# EAGLE design audio_switch (EAGLE 7.4.0)
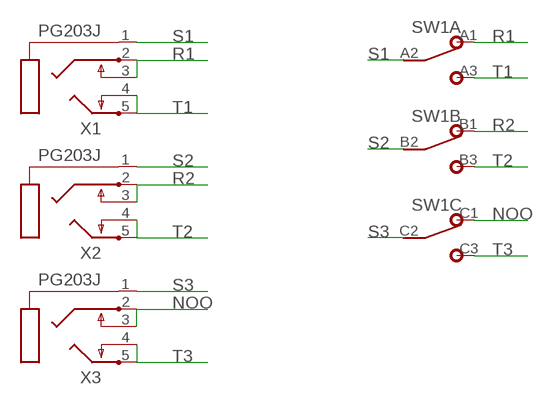
[diagram p0: schematic, sheet 1]

## Parts
SW1  3PDT  [3PDT]
X1  PG203J  [PG203J]
X2  PG203J  [PG203J]
X3  PG203J  [PG203J]

## Nets
NOO: SW1.C1 X3.2 X3.3
R1: SW1.A1 X1.2 X1.3
R2: SW1.B1 X2.2 X2.3
S1: SW1.A2 X1.1
S2: SW1.B2 X2.1
S3: SW1.C2 X3.1
T1: SW1.A3 X1.4 X1.5
T2: SW1.B3 X2.4 X2.5
T3: SW1.C3 X3.4 X3.5

## Library data of the parts
SW1 = gm-switches:3PDT
X1-X3 = con-hirschmann:PG203J: MIC/HEADPHONE JACK KS-S stereo microphone/headphone jack PG203JN (Schukat); OC_FARNELL: unknown; OC_NEWARK: unknown

## Board
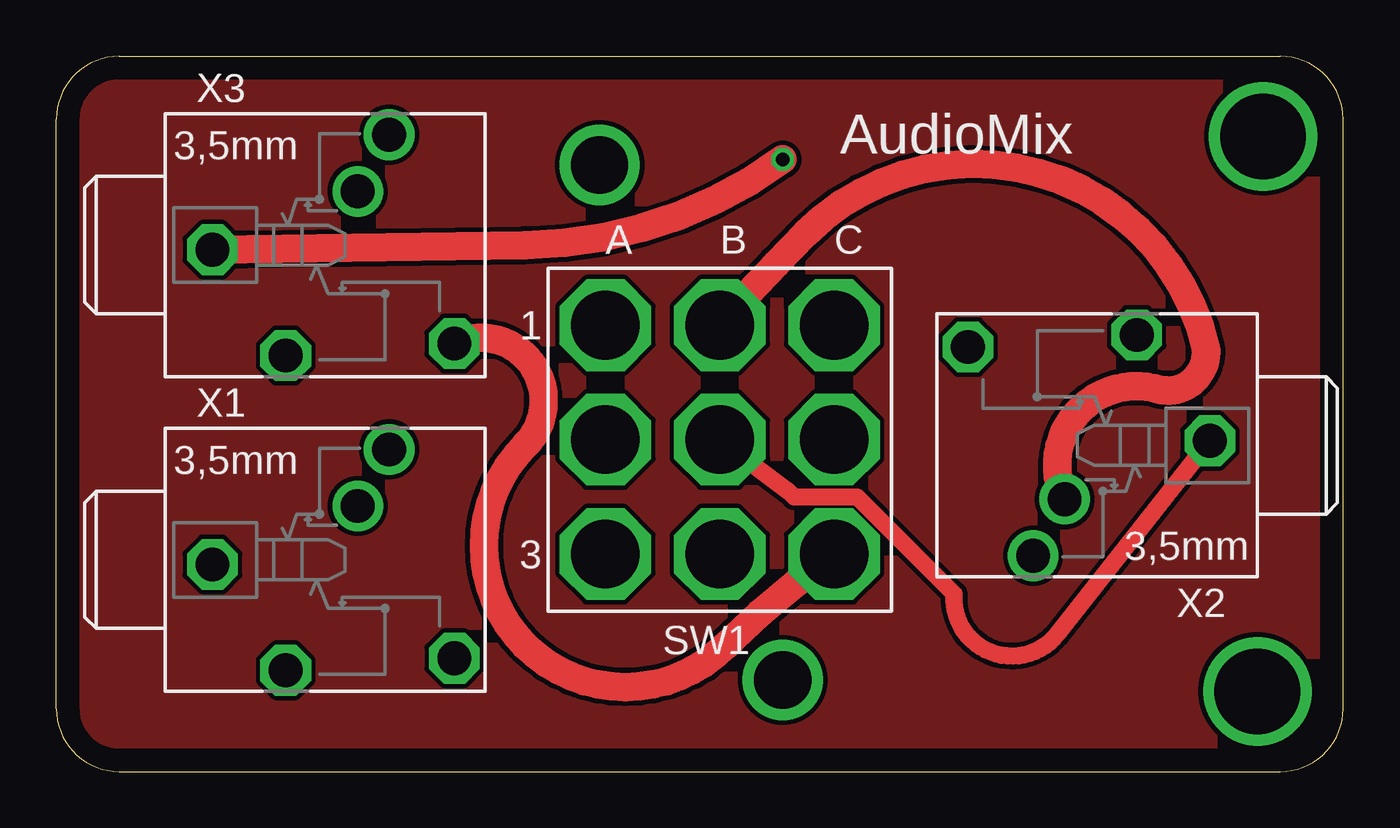
[diagram p1: board, top side]
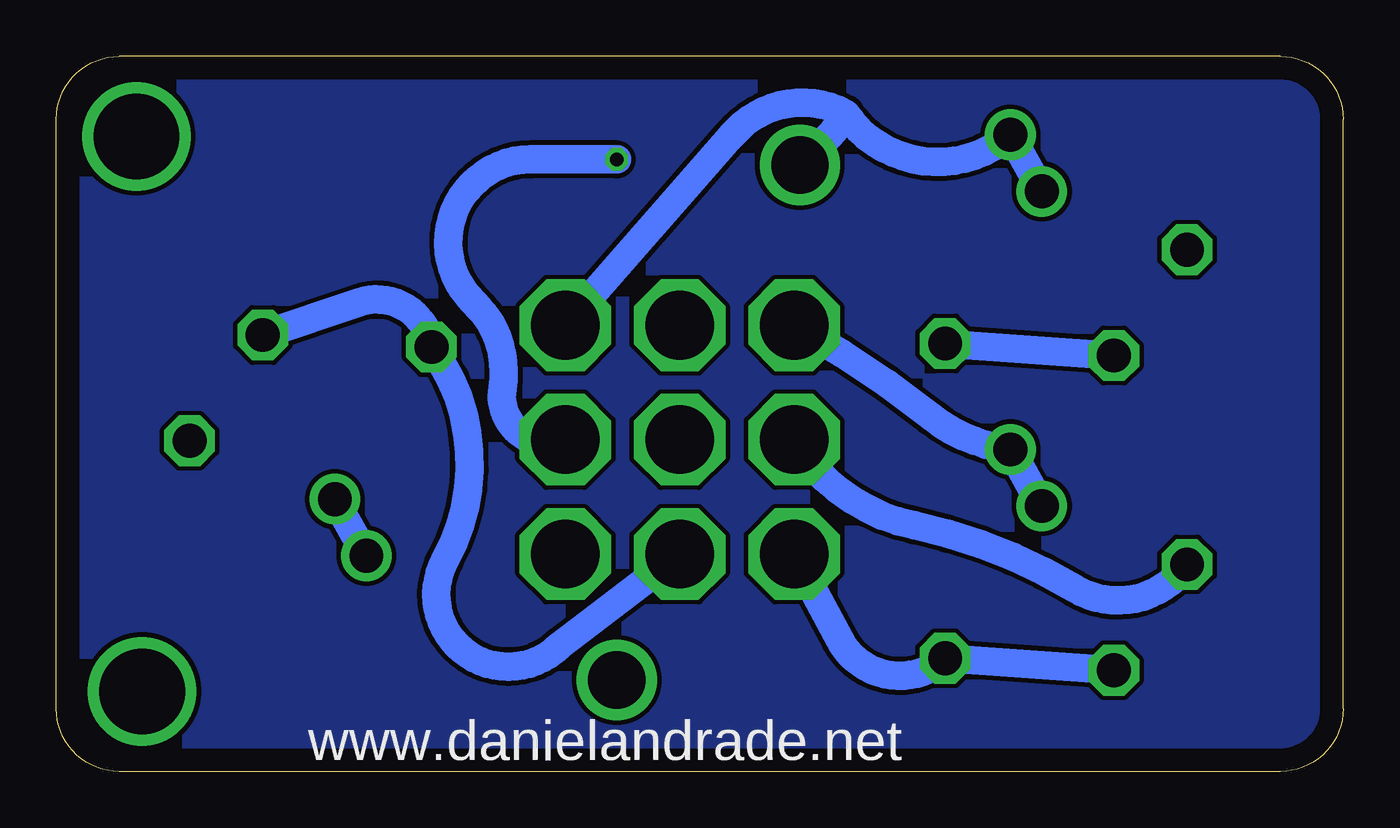
[diagram p2: board, bottom side, seen from below]

Size 57.15 x 31.75 mm. Coordinates in mm from the lower left corner, seen from the top.
Outline: 2.79,0 54.36,0 arc90 57.15,2.79 57.15,28.96 arc90 54.36,31.75 2.79,31.75 arc90 0,28.96 0,2.79 arc90 2.79,0
Copper layers (1*16): Top 0.035mm / dielectric 1.5mm / Bottom 0.035mm
Design rules "default": minimum track width 10mil, minimum drill 24mil, track to track 8mil, track to pad 8mil, pad to pad 8mil, via to via 8mil, smd to smd 8mil, copper to edge 40mil, drill to drill 8mil, minimum pad ring 10mil, minimum via ring 8mil, stop-mask expansion 4mil, vias tented up to drill 0mil, thermal gap 10mil

### Footprints (pad centres in the part's own frame; a part is rotated, then mirrored left to right if it is on the bottom)
3PDT = drill 3.048 pad 3.81 octagon: A1 -5.08,5.08; A2 -5.08,0; A3 -5.08,-5.08; B1 0,5.08; B2 0,0; B3 0,-5.08; C1 5.08,5.08; C2 5.08,0; C3 5.08,-5.08
PG203J = drill 1.499 octagon: 1 -5.004,-0.203; 4 5.74,-4.369; 5 -1.753,-4.902 | drill 1.499: 2 2.845,4.902; 3 1.448,2.388

### Placement (x,y rotation side)
SW1  29.46,14.73 0 top
X1  11.94,9.4 0 top
X2  46.23,14.48 180 top
X3  11.94,23.37 0 top

### Tracks (layer width: path | path; a pad name or v marks a point on that pad's centre or on a via)
N$1  (via drill 3.81)
  other vias: 53.59,28.19
N$2  (via drill 3.81)
  other vias: 53.34,3.56
N$3  (via drill 2.54)
  other vias: 32.26,4.06
N$4
  pour Top: 0.51,28.96 0.51,2.79 arc90 2.79,0.51 54.36,0.51 arc90 56.64,2.79 56.64,28.96 arc90 54.36,31.24 2.79,31.24 arc90
N$5
  pour Bottom: 0.51,29.72 0.51,3.05 arc90 2.54,0.51 54.1,0.51 arc90 56.64,2.79 56.64,29.21 arc90 54.61,31.24 2.79,31.24 arc90
NOO  (via drill 2.54)
  Bottom 1.27: X3.3 X3.2 arc97 22.1,29.21 | 22.1,29.21 arc-80 27.18,28.19 SW1.C1 | v24.13,26.92 22.73,28.32 | 22.73,28.32 22.35,28.7 | 22.1,29.21 22.73,28.32
R1
  Bottom 1.27: X1.3 X1.2 arc32 18.29,15.75 arc-10 SW1.A1
R2
  Top 1.27: X2.3 arc-128 48.77,17.02 arc116 51.05,18.8 arc122 33.27,23.88 arc4 SW1.B1
  Bottom 1.27: X2.2 X2.3
S1
  Bottom 1.27: X1.1 arc86 11.94,8.13 arc-19 19.05,10.92 arc47 SW1.A2
S2
  Top 0.762: X2.1 44.45,6.1 arc-146 39.88,7.87 35.56,12.19 32.77,12.19 32.51,12.45 SW1.B2
S3  (via drill 0.6)
  Top 1.27: X3.1 20.83,23.37 arc35 v32.26,27.18
  Bottom 1.27: v32.26,27.18 36.07,27.18 arc-136 38.61,20.83 arc56 37.34,17.02 arc-120 SW1.C2
T1
  Bottom 1.27: X1.5 X1.4 arc104 22.35,5.84 SW1.A3
T2
  Bottom 1.27: X2.5 43.69,20.83 arc101 X2.4 arc65 39.88,9.4 arc-164 34.8,5.59 SW1.B3
T3
  Top 1.27: X3.4 arc-160 20.83,14.48 arc180 29.72,5.59 arc-10 SW1.C3
  Bottom 1.27: X3.5 X3.4

### Text on the board
bPlace: www.danielandrade.net
tNames: AudioMix